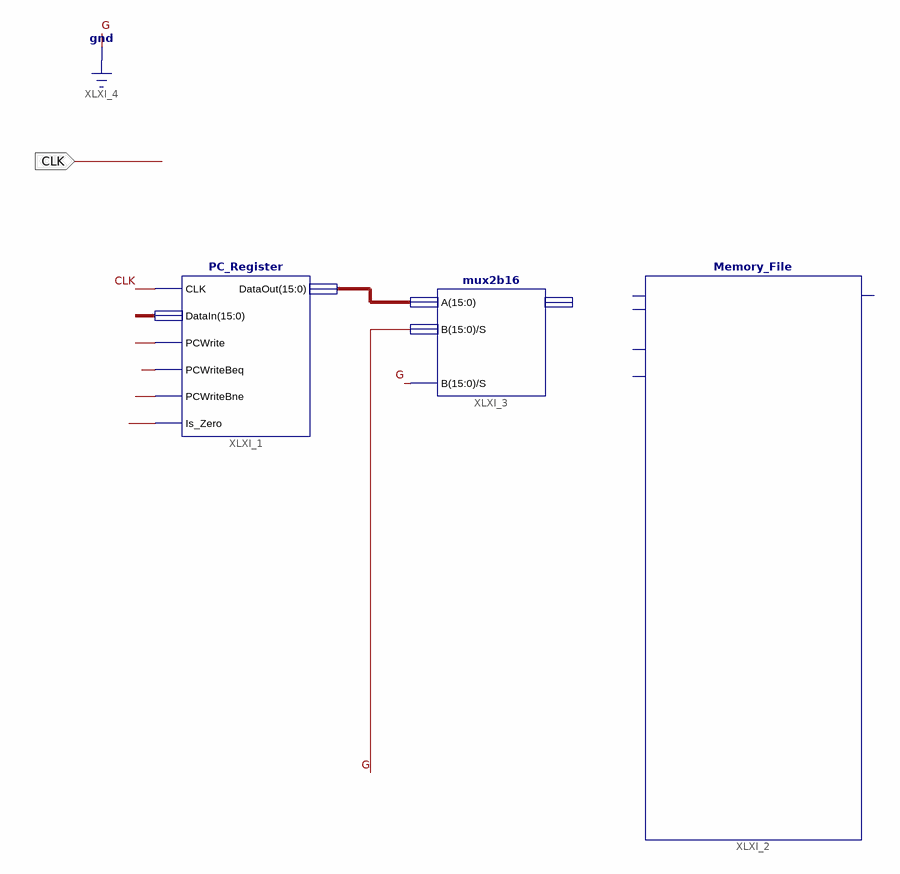
[diagram p0: schematic sheet 1]
// Xilinx ISE schematic FinalProjectDataPath1.sch (spartan3e) as structural Verilog: 3 symbols, 1 ports
module FinalProjectDataPath1 (
  input  CLK
);

  wire XLXN_5, XLXN_6, XLXN_7, XLXN_8;
  wire [15:0] XLXN_3, XLXN_9;

  Memory_File XLXI_2 ();  // open: addra, dina, wea, clka, douta
  PC_Register XLXI_1 (
    .CLK(CLK), .DataIn(XLXN_3), .PCWrite(XLXN_5), .PCWriteBeq(XLXN_6), .PCWriteBne(XLXN_7), .Is_Zero(XLXN_8),
    .DataOut(XLXN_9));
  mux2b16 XLXI_3 (.A(XLXN_9), .B({16{1'b0}}), .S(1'b0));  // open: O
endmodule
